# EAGLE design ti_can (EAGLE 6.1)
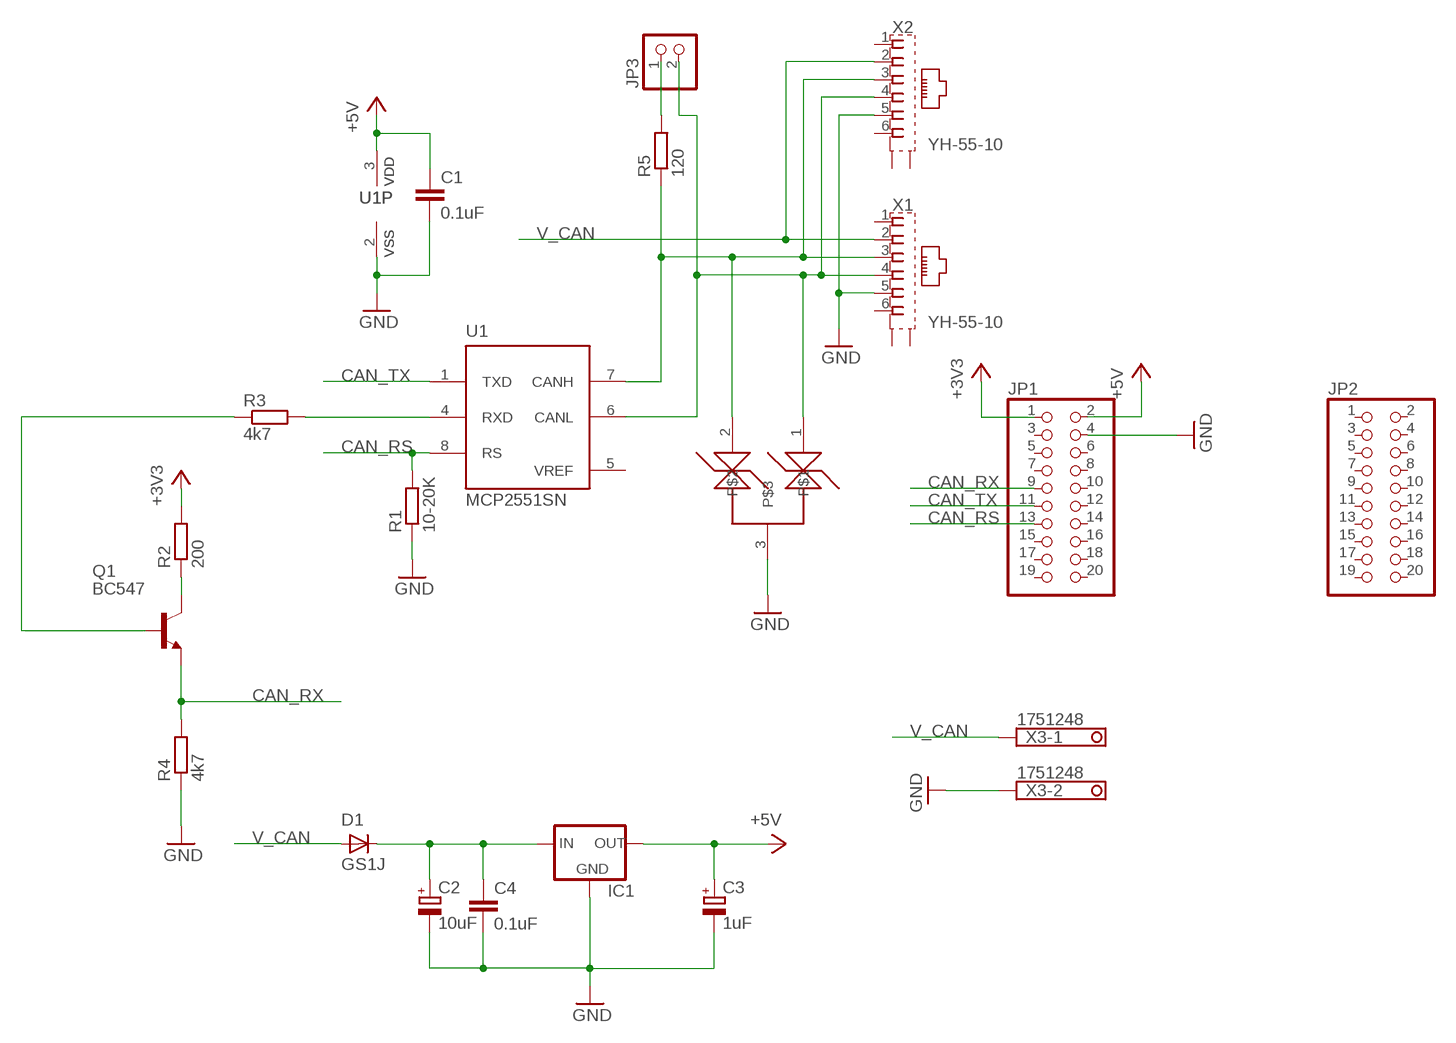
[diagram p0: schematic, sheet 1]

## Parts
C1  0.1uF  C-EUC0805  [C0805]
C2  10uF  CPOL-EUE2,5-6E  [E2,5-6E]
C3  1uF  CPOL-EUE2,5-6E  [E2,5-6E]
C4  0.1uF  C-EUC0805  [C0805]
D1  GS1J  GF1  [SMA-DO214AC]
IC1  LP2950CDT-5.0  [DPACK]
JP1  PINHD-2X10  [2X10]
JP2  PINHD-2X10  [2X10]
JP3  PINHD-1X2  [1X02]
Q1  BC547  [TO92]
R1  10-20K  R-EU_M0805  [M0805]
R2  200  R-EU_M0805  [M0805]
R3  4k7  R-EU_M0805  [M0805]
R4  4k7  R-EU_M0805  [M0805]
R5  120  R-EU_0207/2V  [0207/2V]
U1  MCP2551SN  [SO-08]
U$1  NUP2105L  [SOT23]
X1  YH-55-10  [YH-55-10]
X2  YH-55-10  [YH-55-10]
X3  1751248  [1751248]

## Nets
+3V3: JP1.1 R2.2
+5V: C1.1 C3.+ IC1.3(OUT) JP1.2 U1.3(VDD)
CAN_RS: JP1.13 R1.2 U1.8(RS)
CAN_RX: JP1.9 Q1.1(E) R4.2
CAN_TX: JP1.11 U1.1(TXD)
GND: C1.2 C2.- C3.- C4.2 IC1.4(GND) JP1.4 R1.1 R4.1 U1.2(VSS) U$1.3 X1.5 X2.5 X3.2
N$1: JP3.2 U1.6(CANL) U$1.1 X1.4 X2.4
N$3: Q1.3(C) R2.1
N$4: R3.2 U1.4(RXD)
N$5: Q1.2(B) R3.1
N$6: JP3.1 R5.2
N$7: C2.+ C4.1 D1.K(C) IC1.1(IN)
N$8: R5.1 U1.7(CANH) U$1.2 X1.3 X2.3
V_CAN: D1.A X1.2 X2.2 X3.1
Unconnected: JP1.3 JP1.5 JP1.6 JP1.7 JP1.8 JP1.10 JP1.12 JP1.14 JP1.15 JP1.16 JP1.17 JP1.18 JP1.19 JP1.20 JP2.1 JP2.2 JP2.3 JP2.4 JP2.5 JP2.6 JP2.7 JP2.8 JP2.9 JP2.10 JP2.11 JP2.12 JP2.13 JP2.14 JP2.15 JP2.16 JP2.17 JP2.18 JP2.19 JP2.20 X1.1 X1.6 X1.S1(S) X1.S2(S) X2.1 X2.6 X2.S1(S) X2.S2(S)

## Power pins joined to a net without a drawn wire
VREF: U1.5(VREF)

## Library data of the parts
C1 C4 = rcl:C-EU: CAPACITOR, European symbol
C2 C3 = rcl:CPOL-EU: POLARIZED CAPACITOR, European symbol
D1 = diode:GF1: DIODE
IC1 = v-reg:LP2950?*: Source: http://cache.national.com/ds/LP/LP2950.pdf
JP1 JP2 = pinhead:PINHD-2X10: PIN HEADER
JP3 = pinhead:PINHD-1X2: PIN HEADER
Q1 = transistor-npn:BC547*: NPN Transistor
R1-R5 = rcl:R-EU_: RESISTOR, European symbol
U1 = microchip_can:MCP2551: High Speed CAN tranceiver
U$1 = transistor:NUP2105L
X1 X2 = con-wenzhou-yihua:YH-55-10: RJ11 6 connects Source: YH-55-10.pdf; OC_FARNELL: unknown; OC_NEWARK: unknown
X3 = con-phoenix-350:1751248: MKDS 1/ 2-3,5 Printklemme Nennstrom: 10 A Bemessungsspannung: 160 V Raster: 3,5 mm Polzahl: 2 Montageart: Löten Anschlussart: Schraubanschluss Anschlussrichtung vom Leiter zur Platine: 0° Source: http://eshop.phoenixcontact.com .. 1751248.pdf; OC_FARNELL: unknown; OC_NEWARK: unknown

## Board
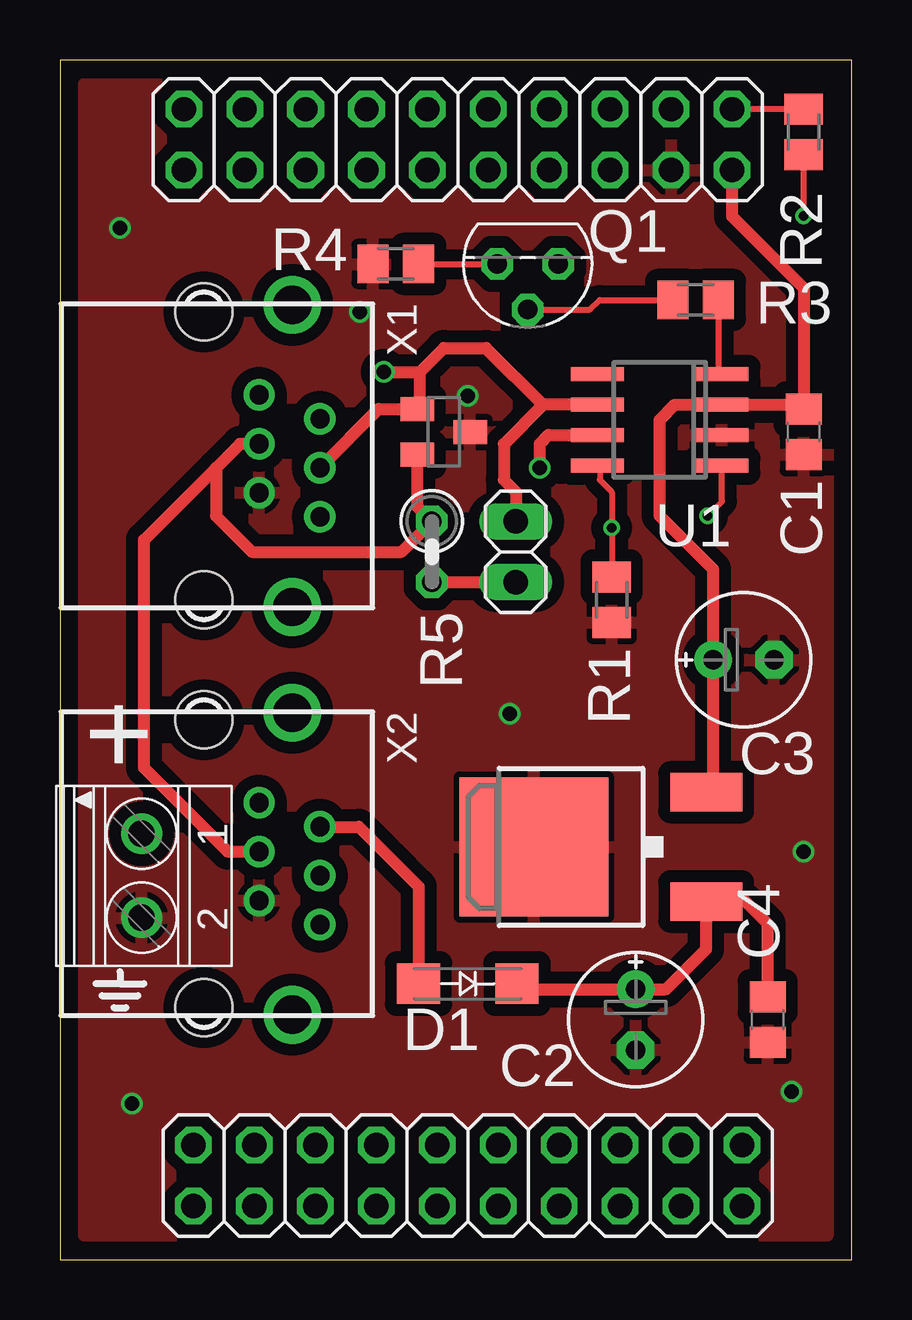
[diagram p1: board, top side]
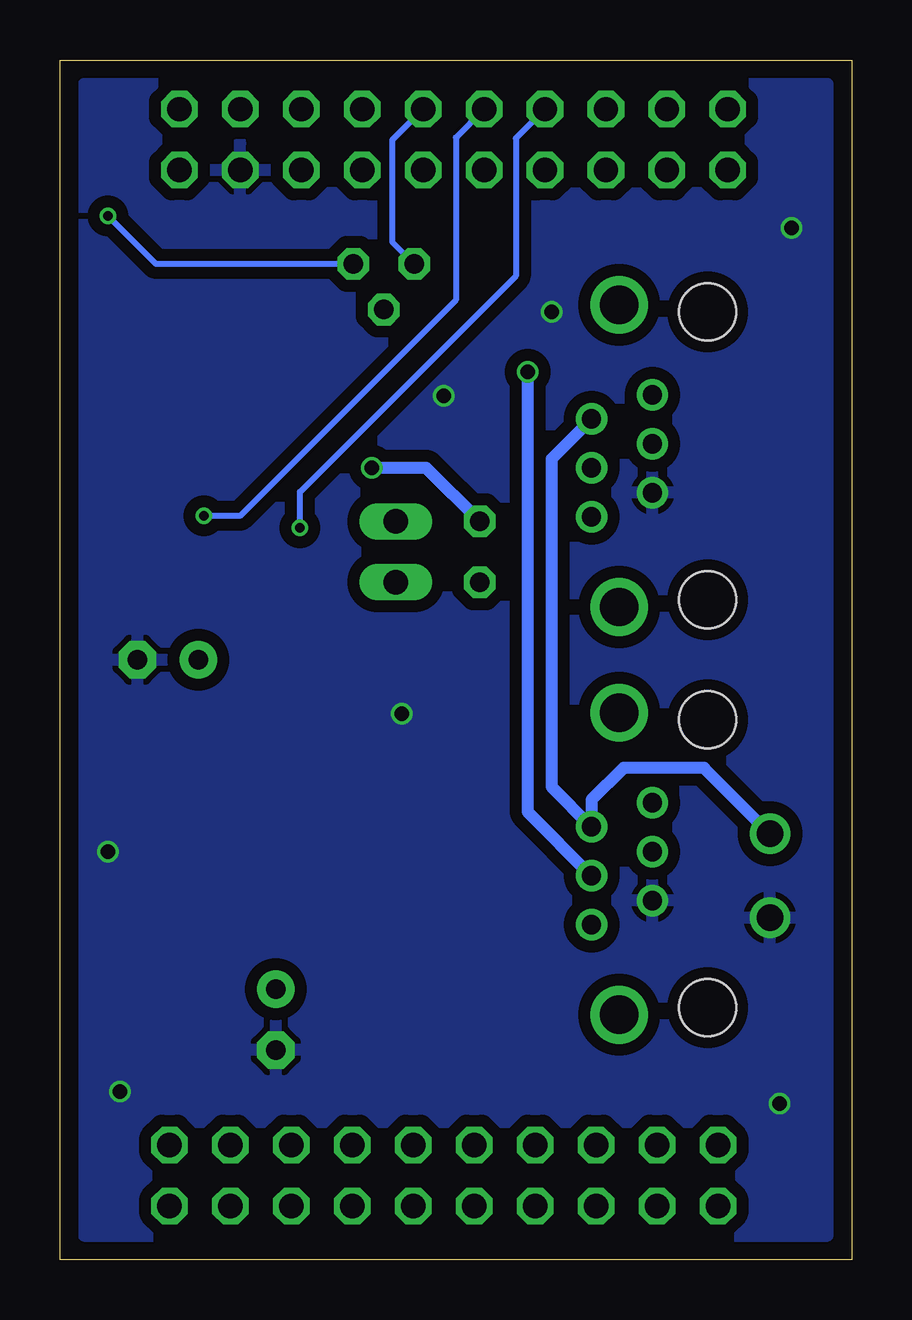
[diagram p2: board, bottom side, seen from below]

Size 33 x 50 mm. Coordinates in mm from the lower left corner, seen from the top.
Outline: 0,0 33,0 33,50 0,50 0,0
Copper layers (1*16): Top 0.035mm / dielectric 1.5mm / Bottom 0.035mm
Design rules: minimum track width 6mil, minimum drill 12mil, track to track 6mil, track to pad 6mil, pad to pad 6mil, via to via 6mil, smd to smd 0mil, copper to edge 10mil, drill to drill 10mil, minimum pad ring 10mil, minimum via ring 6mil, stop-mask expansion 2mil, vias tented up to drill 100mil, thermal gap 10mil

### Footprints (pad centres in the part's own frame; a part is rotated, then mirrored left to right if it is on the bottom)
C0805 = smd 1.3 x 1.5: 1 -0.95,0; 2 0.95,0
E2,5-6E = drill 0.813 pad 1.575: + -1.27,0 | drill 0.813 pad 1.575 octagon: - 1.27,0
SMA-DO214AC = smd 1.8 x 1.7: A -2.05,0; K 2.05,0
DPACK = smd 1.6 x 3: 1 -2.28,-4.8; 3 2.28,-4.8 | smd 5.8 x 6.2: 4 0,2.38
2X10 = drill 1.016 octagon: 1 -11.43,-1.27; 2 -11.43,1.27; 3 -8.89,-1.27; 4 -8.89,1.27; 5 -6.35,-1.27; 6 -6.35,1.27; 7 -3.81,-1.27; 8 -3.81,1.27; 9 -1.27,-1.27; 10 -1.27,1.27; 11 1.27,-1.27; 12 1.27,1.27; 13 3.81,-1.27; 14 3.81,1.27; 15 6.35,-1.27; 16 6.35,1.27; 17 8.89,-1.27; 18 8.89,1.27; 19 11.43,-1.27; 20 11.43,1.27
1X02 = drill 1.016 long: 1 -1.27,0; 2 1.27,0
TO92 = drill 0.813 octagon: 1 1.27,0; 2 0,1.905; 3 -1.27,0
M0805 = smd 1.3 x 1.6: 1 -0.95,0; 2 0.95,0
0207/2V = drill 0.813 octagon: 1 -1.27,0; 2 1.27,0
SO-08 = smd 0.6 x 2.2: 1 -1.905,-2.6; 2 -0.635,-2.6; 3 0.635,-2.6; 4 1.905,-2.6; 5 1.905,2.6; 6 0.635,2.6; 7 -0.635,2.6; 8 -1.905,2.6
SOT23 = smd 1 x 1.4: 1 -0.95,-1.1; 2 0.95,-1.1; 3 0,1.1
YH-55-10 = drill 0.8 pad 1.3: 1 -2.54,2.3; 2 -1.54,4.84; 3 -0.5,2.3; 4 0.5,4.84; 5 1.54,2.3; 6 2.54,4.84 | drill 1.6 pad 2.184: S1 -6.3,3.68; S2 6.3,3.68 | hole 2.36: -6,0; 6,0
1751248 = drill 1.1 pad 1.7: 1 -1.75,-0.1; 2 1.75,-0.1

### Placement (x,y rotation side)
C1  31,34.5 270 top
C2  24,10 270 top
C3  28.5,25 0 top
C4  29.5,10 270 top
D1  17,11.5 0 top
IC1  22.14,17.2 90 top
JP1  16.59,46.68 180 top
JP2  17,3.5 0 top
JP3  19,29.5 90 top
Q1  19.5,41.5 180 top
R1  23,27.5 90 top
R2  31,47 90 top
R3  26.5,40 0 top
R4  14,41.5 0 top
R5  15.5,29.5 270 top
U1  25,35 90 top
U$1  16,34.5 270 top
X1  6,33.5 270 top
X2  6,16.5 270 top
X3  3.5,16 270 top

### Tracks (layer width: path | path; a pad name or v marks a point on that pad's centre or on a via)
+3V3
  Top 0.25: R2.2 JP1.1
+5V
  Top 0.5: IC1.3 27.23,19.77 C3.+ 27.23,28.77 25,31 25,35 25.64,35.63 U1.3 30.82,35.63 C1.1 31,40.5 28.02,43.48 JP1.2
CAN_RS  (via drill 0.4)
  Top 0.25: R1.2 v23,30.5 23,32 22.5,32.5 22.5,32.99 U1.8
  Bottom 0.25: JP1.13 14,46.73 14,41 23,32 v23,30.5
CAN_RX
  Top 0.25: R4.2 Q1.1
  Bottom 0.25: JP1.9 19.15,46.66 19.15,42.42 Q1.1
CAN_TX  (via drill 0.4)
  Top 0.25: U1.1 27.6,31.6 v27,31
  Bottom 0.25: JP1.11 16.5,46.77 16.5,40 25.5,31 v27,31
GND  (via drill 0.6)
  other vias: 2.5,43 3,6.5 30.5,7 31,17 12.5,39.5 17,36 18.75,22.75
  pour Bottom (isolate 0.5): 1,49 32,49 32,1 1,1
  pour Top (isolate 0.5): 1,49 32,49 32,1 1,1
N$1  (via drill 0.6)
  Top 0.5: X1.4 13.29,35.45 U$1.1 15,35.55 15,37 | U1.6 20.14,35.63 | 20.14,35.63 18.5,34 18.5,32.5 19,32 JP3.2 | 15,37 16,38 17.77,38 20.14,35.63 | v13.5,37 15,37
  Bottom 0.5: X2.4 13.5,18.66 v13.5,37
N$3  (via drill 0.4)
  Top 0.25: v31,43.5 R2.1
  Bottom 0.25: Q1.3 29,41.5 v31,43.5
N$4
  Top 0.25: R3.2 27.45,37.05 U1.4
N$5
  Top 0.25: Q1.2 22.09,39.59 22.5,40 R3.1
N$6
  Top 0.5: R5.2 JP3.1
N$7
  Top 0.5: D1.K 19.28,11.27 C2.+ 25.27,11.27 26.94,12.94 IC1.1 28.58,14.92 29.5,14 C4.1
N$8  (via drill 0.6)
  Top 0.5: X1.3 7.5,34 6.5,33 | 6.5,33 6.5,31 8,29.5 14.23,29.5 R5.1 14.9,31.37 U$1.2 | v20,33 20,34 20.36,34.37 U1.7 | X2.3 7,17 3.5,20.5 3.5,30 6.5,33
  Bottom 0.5: R5.1 17.73,33 v20,33
V_CAN
  Top 0.5: X2.2 12.46,18.04 14.95,15.55 D1.A
  Bottom 0.5: X1.2 12.5,33.38 12.5,19.7 X2.2 10.84,19.16 9.5,20.5 6.15,20.5 X3.1

### Text on the board
tPlace: +